# Altium schematic sheet CAN.SchDoc
size A4
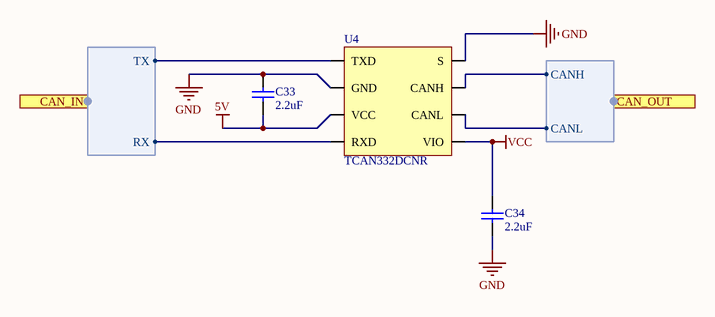
[diagram p0: CAN.SchDoc]

## Parts
C33  value 2.2uF  [C0603[1608X92]]  (hidden comment: 2.2uF 6.3V 0603)
C34  value 2.2uF  [C0603[1608X92]]  (hidden comment: 2.2uF 6.3V 0603)
U4  TCAN332DCNR  [SOT-23-8]

## Ports
CAN_IN (harness CAN Input), CAN_OUT (harness CAN Output)

## Harnesses
CAN Input: TX, RX
CAN Output: CANH, CANL

## Nets
5V: C33.1 U4.3(VCC)
GND: C33.2 C34.1 U4.2(GND) U4.8(S)
VCC: C34.2 U4.5(VIO)
NetU4_1: U4.1(TXD) ; port CAN_IN.TX
NetU4_4: U4.4(RXD) ; port CAN_IN.RX
NetU4_6: U4.6(CANL) ; port CAN_OUT.CANL
NetU4_7: U4.7(CANH) ; port CAN_OUT.CANH

## Library data of the parts
C33 C34 = CAP_2.2uF_6.3V_0603_10%: 2.2uF 6.3V 10% 0603 (1608 Metric); PartNumber: GRM185R60J225KE26D; Manufacturer: Murata; TemperatureCoefficient: X5R; Mounting Technology: Surface Mount; PackageReference: 0603; PackageDescription: 0603 (1608 Metric); Voltage: 6.3V; Tolerance: 10%
U4 = TJA1051T/3: CAN Interface IC 5V CAN Transceivers 8-SOT-23 -40 to 150; Manufacturer: NXP Semiconductors; Mounting Technology: Surface Mount; PackageReference: SOT-23-8; PackageDescription: SOT23, 8-Leads; PartNumber: TJA1051T/3